# EasyEDA Pro project 51温度传感器.eprj

# Schematic Schematic1
Create Date: 2024-03-05; Page Name: P1; Project Name: 51温度传感器; Schematic Name: Schematic1; Update Date: 2024-03-05; Company: 嘉立创EDA; Page Size: A4; Version: V1.0
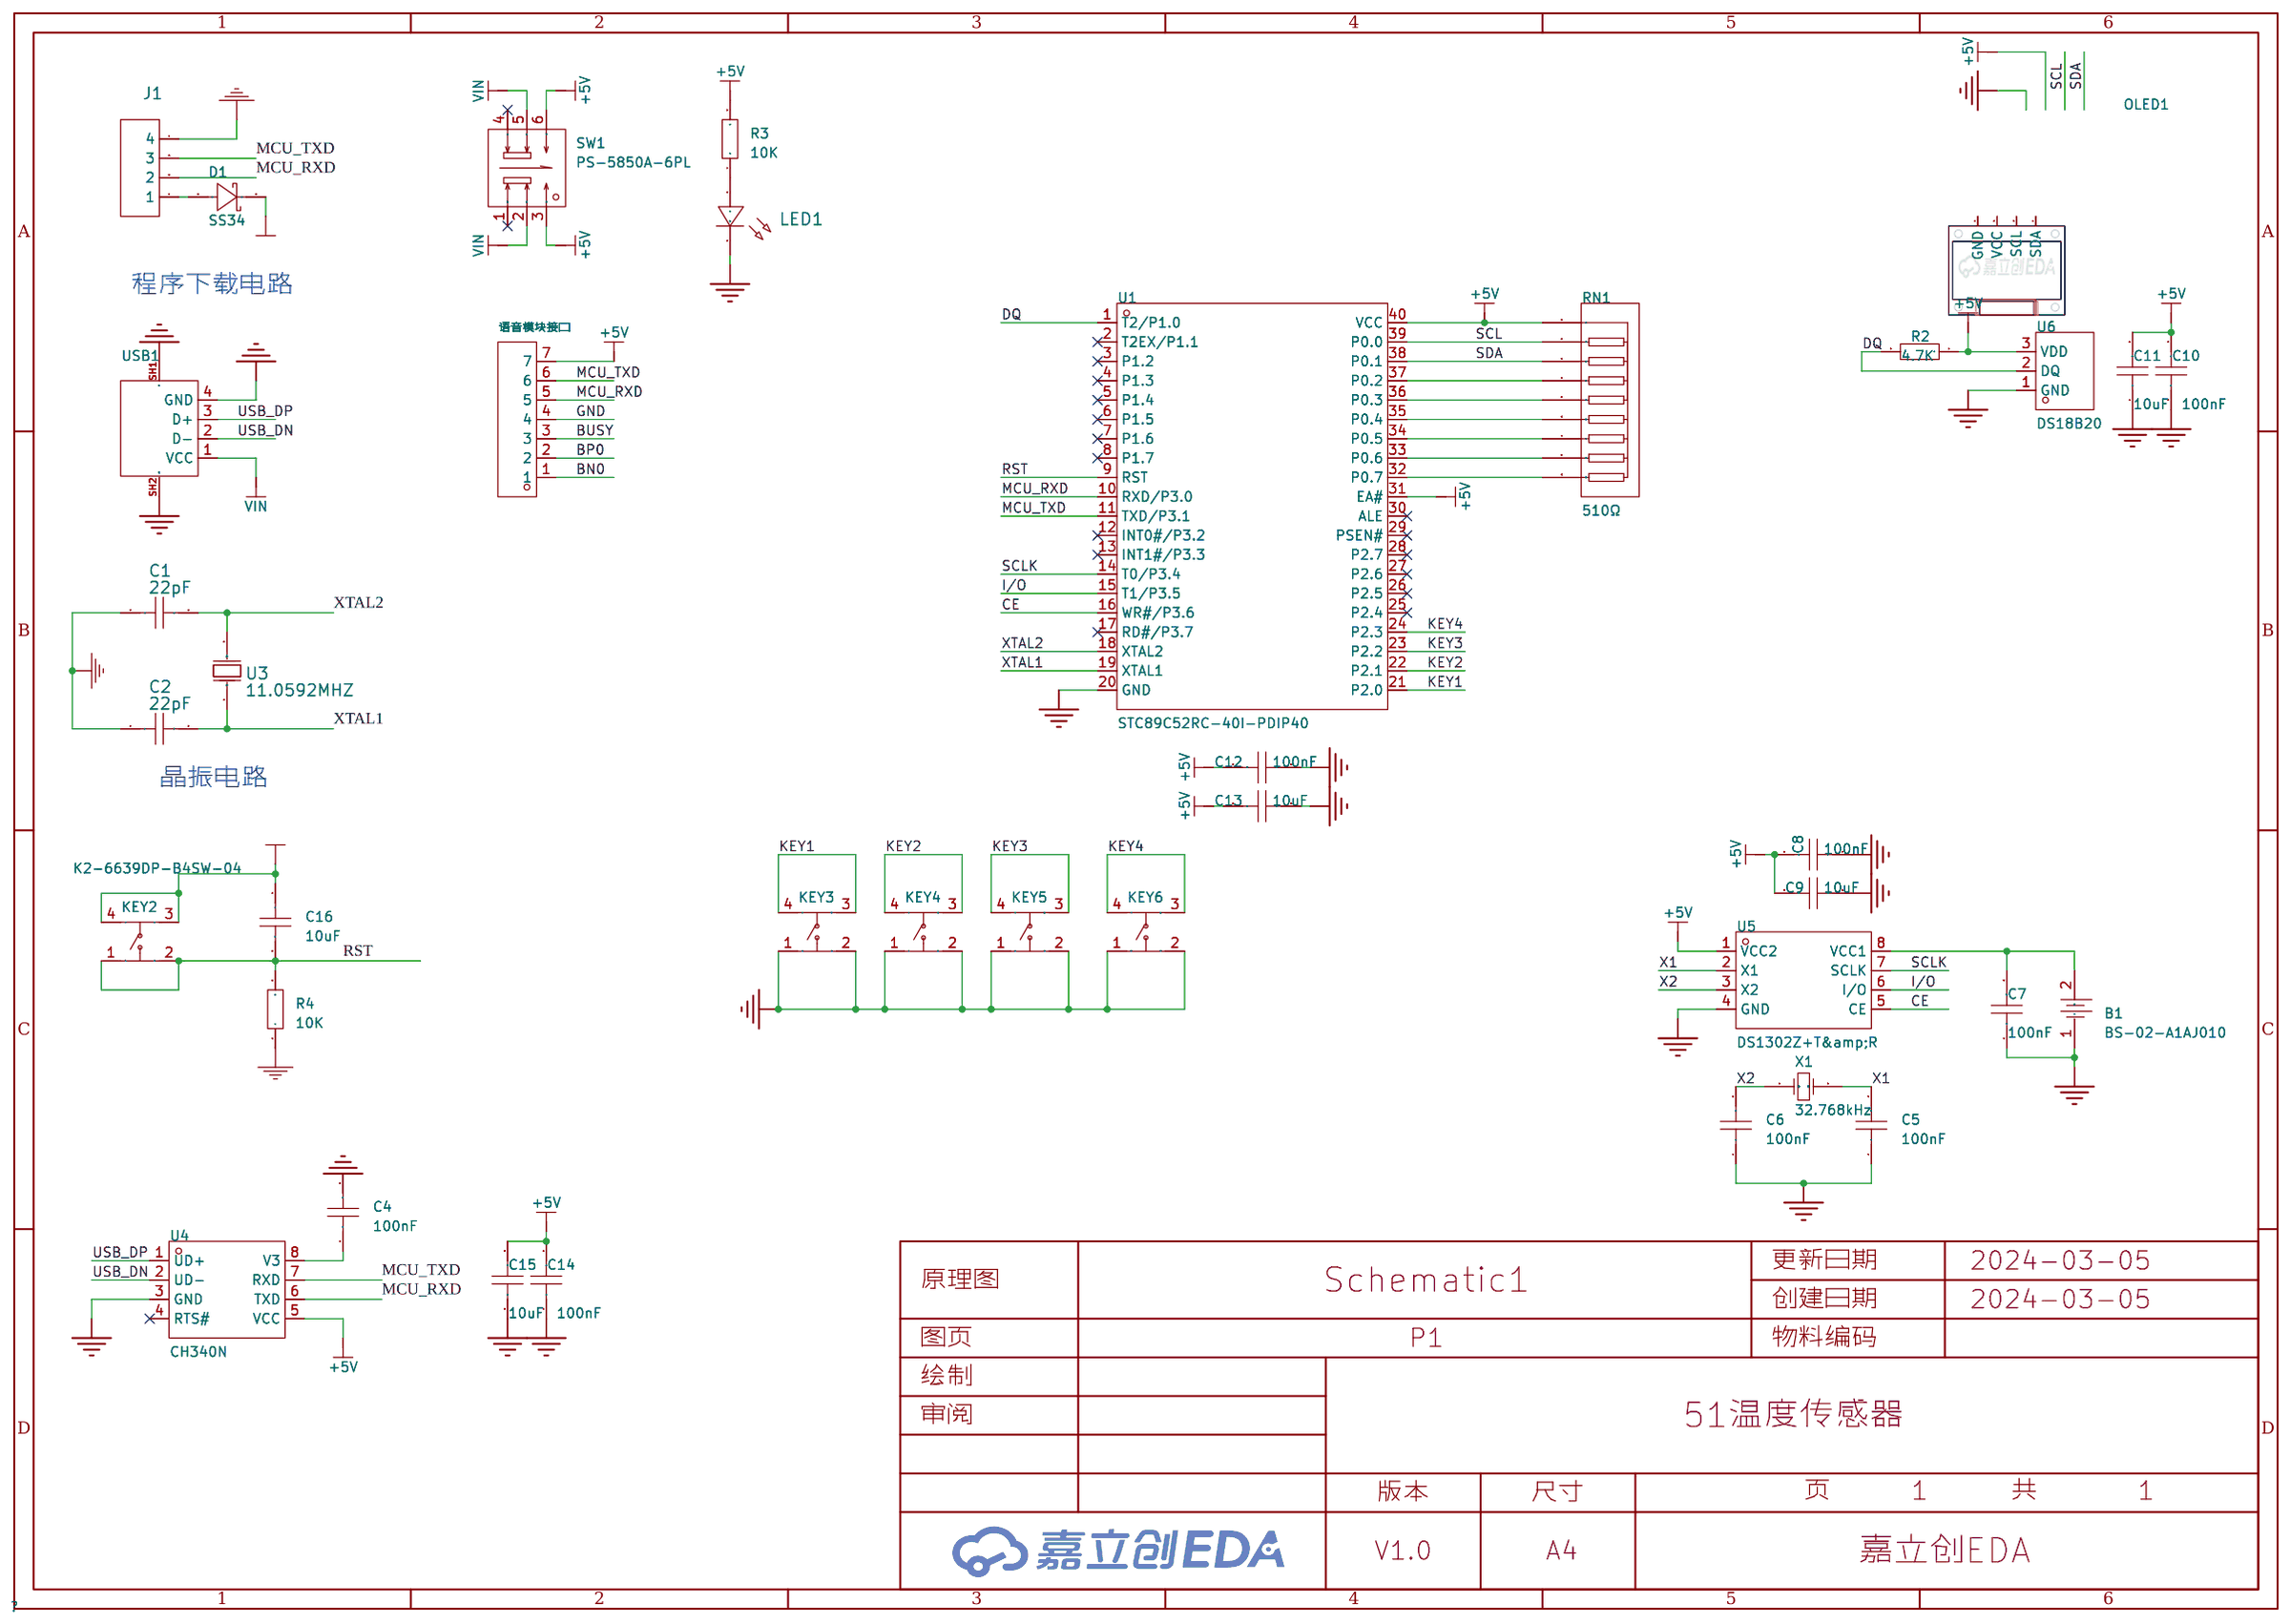
[diagram p0: schematic sheet]

## Parts
B1  BS-02-A1AJ010  [BAT-TH_BS-02-A1AJ010]
C1  22pF  [C0603]
C2  22pF  [C0603]
C4  100nF  [C0603]
C5  100nF  [C0603]
C6  100nF  [C0603]
C7  100nF  [C0603]
C8  100nF  [C0603]
C9  10uF  [C0603]
C10  100nF  [C0603]
C11  10uF  [C0603]
C12  100nF  [C0603]
C13  10uF  [C0603]
C14  100nF  [C0603]
C15  10uF  [C0603]
C16  10uF  [C0603]
D1  SS34  [SMA_L4.3-W2.5-LS5.0-RD]
J1  HDR-M-2.54_1x4  [HDR-M-2.54_1X4]
KEY2  K2-6639DP-B4SW-04  [KEY-TH_4P-L6.0-W6.0-P3.90-LS7.8]
KEY3  K2-6639DP-B4SW-04  [KEY-TH_4P-L6.0-W6.0-P3.90-LS7.8]
KEY4  K2-6639DP-B4SW-04  [KEY-TH_4P-L6.0-W6.0-P3.90-LS7.8]
KEY5  K2-6639DP-B4SW-04  [KEY-TH_4P-L6.0-W6.0-P3.90-LS7.8]
KEY6  K2-6639DP-B4SW-04  [KEY-TH_4P-L6.0-W6.0-P3.90-LS7.8]
LED1  -  [LED_0603]
OLED1  -  [0.96OLED_4P]
R2  4.7K  [R0603]
R3  10K  [R0603]
R4  10K  [R0603]
RN1  510Ω  [RES-ARRAY-TH_9P-P2.54-D1.0]
SW1  PS-5850A-6PL  [SW-TH_6P-L5.8-W5.8-P2.00-LS4.5-BL]
U1  STC89C52RC-40I-PDIP40  [DIP-40_L52.0-W13.7-P2.54-LS15.2-BL]
U3  11.0592MHZ  [HC-49US_L11.5-W4.5-P4.88]
U4  CH340N  [SOP-8_L5.0-W4.0-P1.27-LS6.0-BL]
U5  DS1302Z+T&amp;R  [SOIC-8_L4.9-W3.9-P1.27-LS6.0-BL]
U6  DS18B20  [TO-92-3_L4.9-W3.7-P1.27-L]
USB1  -  [USB_ Type-A]
X1  32.768kHz  [OSC-TH_BD1.0-P0.50]
语音模块接口  -  [HDR-TH_7P-P2.54-V-M]

## Library data of the parts
B1 = BS-02-A1AJ010: 连接器类型:电池底座;适用电池规格:CR2032;工作温度范围:-25℃~+85℃;; LCSC Part Name: 电池底座 适用电池:CR2032; Supplier Part: C5239862; Manufacturer: MYOUNG(美阳); Supplier Footprint: 插件; JLCPCB Part Class: 扩展库; Datasheet: https://atta.szlcsc.com/upload/public/pdf/source/20221102/8F00F2B23A2A3C447A59C327BBA6C743.pdf; Supplier: LCSC; Connector Type: 电池底座; Battery Type: CR2032; Operating Temperature Range: -25℃~+85℃
C1 C2 = 22pF: link: https://item.szlcsc.com/362304.html; 3DModel: C0603_L1.6-W0.8-H0.8
C4-C16 = CAP_0603: Supplier Footprint: 0603
D1 = SS34_C727060: 二极管配置:独立式;正向压降(Vf):550mV@3A;直流反向耐压(Vr):40V;平均整流电流(Io):3A;; LCSC Part Name: 电压:40V 电流:3A; Supplier Part: C727060; Manufacturer: TWGMC(台湾迪嘉); Supplier Footprint: SMA(DO-214AC); JLCPCB Part Class: Extended Part; Datasheet: https://atta.szlcsc.com/upload/public/pdf/source/20200828/C727059_6599B6CAC5F3238B9C33E46794659DBE.pdf; Supplier: LCSC; Diode Configuration: 独立式; Forward Voltage (Vf@If): 550mV@3A; Reverse Voltage (Vr): 40V; Average Rectified Current (Io): 3A; Reverse Leakage Current (Ir): 500uA@40V
J1 = HDR-M-2.54_1x4: Supplier Part: C124378; Supplier: LCSC
KEY2-KEY6 = K2-6639DP-B4SW-04: 电路结构:单刀单掷;按钮形状:圆形按钮;作用力:250gf;安装方式:直插;开关长度:6mm;开关宽度:6mm;开关高度:4.5mm;触点电流:50mA;额定电压(DC):12V;绝缘电阻:100MΩ;带灯:-;机械寿命:100万次;; LCSC Part Name: 6x6x4.5mm 轻触按键; Supplier Part: C83205; Manufacturer: 韩国韩荣; Supplier Footprint: 插件; JLCPCB Part Class: 扩展库; Datasheet: https://atta.szlcsc.com/upload/public/pdf/source/20200930/C879729_D64208FBC493D1F79DAD0BCE8DC57AB4.pdf; Supplier: LCSC; Circuit: 单刀单掷; Actuator Style: 圆形按钮; Operating Force: 250gf; Mounting Style: 直插; Switch Length: 6mm; Switch Width: 6mm; Switch Height: 4.5mm; Contact Current: 50mA; Voltage Rating (DC): 12V; Insulation Resistance: 100MΩ; Mechanical Life: 100万次; Operating Temperature: -25℃~+85℃
LED1 = LED_0603-R: Supplier Footprint: 0603
OLED1 = 0.96OLED模块_4P: Supplier Footprint: 插件
R2-R4 = Res_0603: Supplier Footprint: 0603
RN1 = A09-511JP: 电阻器数:8;阻值:510Ω;精度:±5%;单个元件功率:125mW;温度系数:±100ppm/℃;; LCSC Part Name: 510Ω ±5%; Supplier Part: C88134; Manufacturer: FH(风华); Supplier Footprint: SIP-9-2.54mm; JLCPCB Part Class: 扩展库; Datasheet: https://atta.szlcsc.com/upload/public/pdf/source/20181030/C304054_A50D38FAF64ED3A213CD1DFA70BBC452.pdf; Supplier: LCSC; Number of Resistors: 8; Tolerance: ±5%; Power(Watts): 125mW; Temperature Coefficient: ±100ppm/℃; Number of Pins: 9
SW1 = PS-5850A-6PL: 5.8自锁按键开关 高头 耐高温; LCSC Part Name: 自锁按键开关; Supplier Part: C963201; Manufacturer: G-Switch(品赞); Supplier Footprint: 插件,5.8x5.8x10mm; JLCPCB Part Class: Extended Part; Datasheet: https://atta.szlcsc.com/upload/public/pdf/source/20201201/C963201_9229C247AC907A82E381B4EE0BC1DEDE.pdf; Supplier: LCSC
U1 = STC89C52RC-40I-PDIP40: CPU内核:51系列;程序存储容量:8KB;RAM总容量:512Byte;GPIO端口数量:35;工作电压范围:3.3V~5.5V;CPU最大主频:-;程序存储器类型:FLASH;; Supplier Part: C14022; Manufacturer: STC(宏晶); Supplier Footprint: DIP-40; JLCPCB Part Class: 扩展库; Datasheet: https://atta.szlcsc.com/upload/public/pdf/source/20210104/C14022_3E6032FDBB5DBC6F971AD019A8472F5B.pdf; Supplier: LCSC; CPU Core: 51系列; Program Storage Size: 8KB; RAM Size: 512Byte; GPIO Ports Number: 35; Operating Voltage Range: 3.3V~5.5V; Program Memory Type: FLASH; Operating Temperature Range: -40℃~+85℃; 16Bit Timer: 3; UART/USART: 1; Peripheral/Function: 看门狗; Watchdog: 有
U3 = 11.0592MHZ: link: https://lcsc.com/product-detail/DIP-Crystal-Resonators_Made-in-China-Made-in-China-37-5Mhz-20PF-20PPM_C52062.html; 3DModel: HC-49US_L11.0-W4.5-H3.5-P4.88; Supplier: LCSC; Supplier Part: C2636398; Manufacturer: TXC(台湾晶技); Manufacturer Part: 9B-11.0592MAAJ-B; JLCPCB Part Class: ExtendedPart
U4 = CH340N_C506813: 应用功能:-;接口协议:-;; LCSC Part Name: USB转串口芯片 CH340; Supplier Part: C506813; Manufacturer: WCH(南京沁恒); Supplier Footprint: SOP-8; JLCPCB Part Class: 扩展库; Datasheet: https://atta.szlcsc.com/upload/public/pdf/source/20200819/C84681_ADBED554CE321879DBD6B1D06488689C.pdf; Supplier: LCSC
U5 = DS1302Z+T&R: 接口:SPI;; Supplier Part: C8959; Manufacturer: ADI(亚德诺)/MAXIM(美信); Supplier Footprint: SOIC-8; JLCPCB Part Class: 扩展库; Datasheet: https://atta.szlcsc.com/upload/public/pdf/source/20130705/1457706621880.pdf; Supplier: LCSC; Interface: SPI; Operating Voltage: 2V~5.5V; Operating Temperature: 0℃~+70℃
U6 = DS18B20_C5379069: 温度范围:-55℃~+125℃;精度:±0.4℃;接口类型:-;; Supplier Part: C5379069; Manufacturer: MSKSEMI(美森科); Supplier Footprint: TO-92; JLCPCB Part Class: Extended Part; Datasheet: https://atta.szlcsc.com/upload/public/pdf/source/20230321/E2B7C84673F98AE08C6B0E4EDF67430D.pdf; Supplier: LCSC; Temperature range: -55℃~+125℃; Resolution: ±0.4℃; Supply Voltage: 2.5V~5.5V; Standby Current: 750nA
USB1 = USB_ Type-A: Supplier Footprint: 插件
X1 = K153276812520: 晶振类型:直插晶振;频率:32.768kHz;常温频差:±20ppm;外接负载电容:12.5pF;频率稳定度(全温):±20ppm;; LCSC Part Name: 32.768kHz ±20ppm 12.5pF; Supplier Part: C368784; Manufacturer: KYX(凯越翔); Supplier Footprint: DT-15; JLCPCB Part Class: 扩展库; Datasheet: https://atta.szlcsc.com/upload/public/pdf/source/20190218/C368784_8FA95DFC5BE0B4C124C1750D22619549.pdf; Supplier: LCSC; Crystal Type: 直插晶振; Normal temperature Frequency Tolerance: ±20ppm; External load capacitor: 12.5pF; Frequency Stability(Full temperature range): ±20ppm; Equivalent Series Resistance (ESR): 70kΩ; Operating Temperature: -20℃~+70℃
语音模块接口 = HDR-M_2.54_1x7P: Supplier Part: C492406; Supplier Footprint: 插件

## Nets
+5V: C8.2 C9.2 C10.2 C11.2 C12.2 C13.2 C14.2 C15.2 C16.1 D1.1(C) KEY2.3 KEY2.4 R2.1 R3.2 RN1.1 SW1.3 SW1.6 U1.31(EA#) U1.40(VCC) U4.5(VCC) U5.1(VCC2) U6.3(VDD) 语音模块接口.7
GND: B1.1 C1.1 C2.1 C4.2 C5.1 C6.1 C7.1 C8.1 C9.1 C10.1 C11.1 C12.1 C13.1 C14.1 C15.1 J1.4 KEY3.1 KEY3.2 KEY4.1 KEY4.2 KEY5.1 KEY5.2 KEY6.1 KEY6.2 LED1.1(C) R4.1 U1.20(GND) U4.3(GND) U5.4(GND) U6.1(GND) USB1.4(GND) USB1.SH1 USB1.SH2 语音模块接口.4
VIN: SW1.2 SW1.5 USB1.1(VCC)
BN0: 语音模块接口.1
BP0: 语音模块接口.2
BUSY: 语音模块接口.3
CE: U1.16(WR#/P3.6) U5.5(CE)
DQ: R2.2 U1.1(T2/P1.0) U6.2(DQ)
I/O: U1.15(T1/P3.5) U5.6(I/O)
KEY1: KEY3.3 KEY3.4 U1.21(P2.0)
KEY2: KEY4.3 KEY4.4 U1.22(P2.1)
KEY3: KEY5.3 KEY5.4 U1.23(P2.2)
KEY4: KEY6.3 KEY6.4 U1.24(P2.3)
MCU_RXD: J1.2 U1.10(RXD/P3.0) U4.6(TXD) 语音模块接口.5
MCU_TXD: J1.3 U1.11(TXD/P3.1) U4.7(RXD) 语音模块接口.6
RST: C16.2 KEY2.1 KEY2.2 R4.2 U1.9(RST)
SCL: RN1.2 U1.39(P0.0)
SCLK: U1.14(T0/P3.4) U5.7(SCLK)
SDA: RN1.3 U1.38(P0.1)
USB_DN: U4.2(UD-) USB1.2(D-)
USB_DP: U4.1(UD+) USB1.3(D+)
X1: C5.2 U5.2(X1) X1.2(OSC2)
X2: C6.2 U5.3(X2) X1.1(OSC1)
XTAL1: C2.2 U1.19(XTAL1) U3.1(OSC1)
XTAL2: C1.2 U1.18(XTAL2) U3.2(OSC2)
$1N559: RN1.4 U1.37(P0.2)
$1N560: RN1.5 U1.36(P0.3)
$1N561: RN1.6 U1.35(P0.4)
$1N562: RN1.7 U1.34(P0.5)
$1N563: RN1.8 U1.33(P0.6)
$1N564: RN1.9 U1.32(P0.7)
$1N848: D1.2(A) J1.1
$1N1132: C4.1 U4.8(V3)
$1N1910: B1.2 C7.2 U5.8(VCC1)
Net-(LED1-2): LED1.2(A) R3.1

Not connected (* = marked no-connect by the designer): OLED1 1(GND) 2(VCC) 3(SCL) 4(SDA); SW1 1* 4*; U1 2(T2EX/P1.1)* 3(P1.2)* 4(P1.3)* 5(P1.4)* 6(P1.5)* 7(P1.6)* 8(P1.7)* 12(INT0#/P3.2)* 13(INT1#/P3.3)* 17(RD#/P3.7)* 25(P2.4)* 26(P2.5)* 27(P2.6)* 28(P2.7)* 29(PSEN#)* 30(ALE)*; U4 4(RTS#)*

## Notes on the sheet
- 程序下载电路
- 晶振电路

# Board PCB1
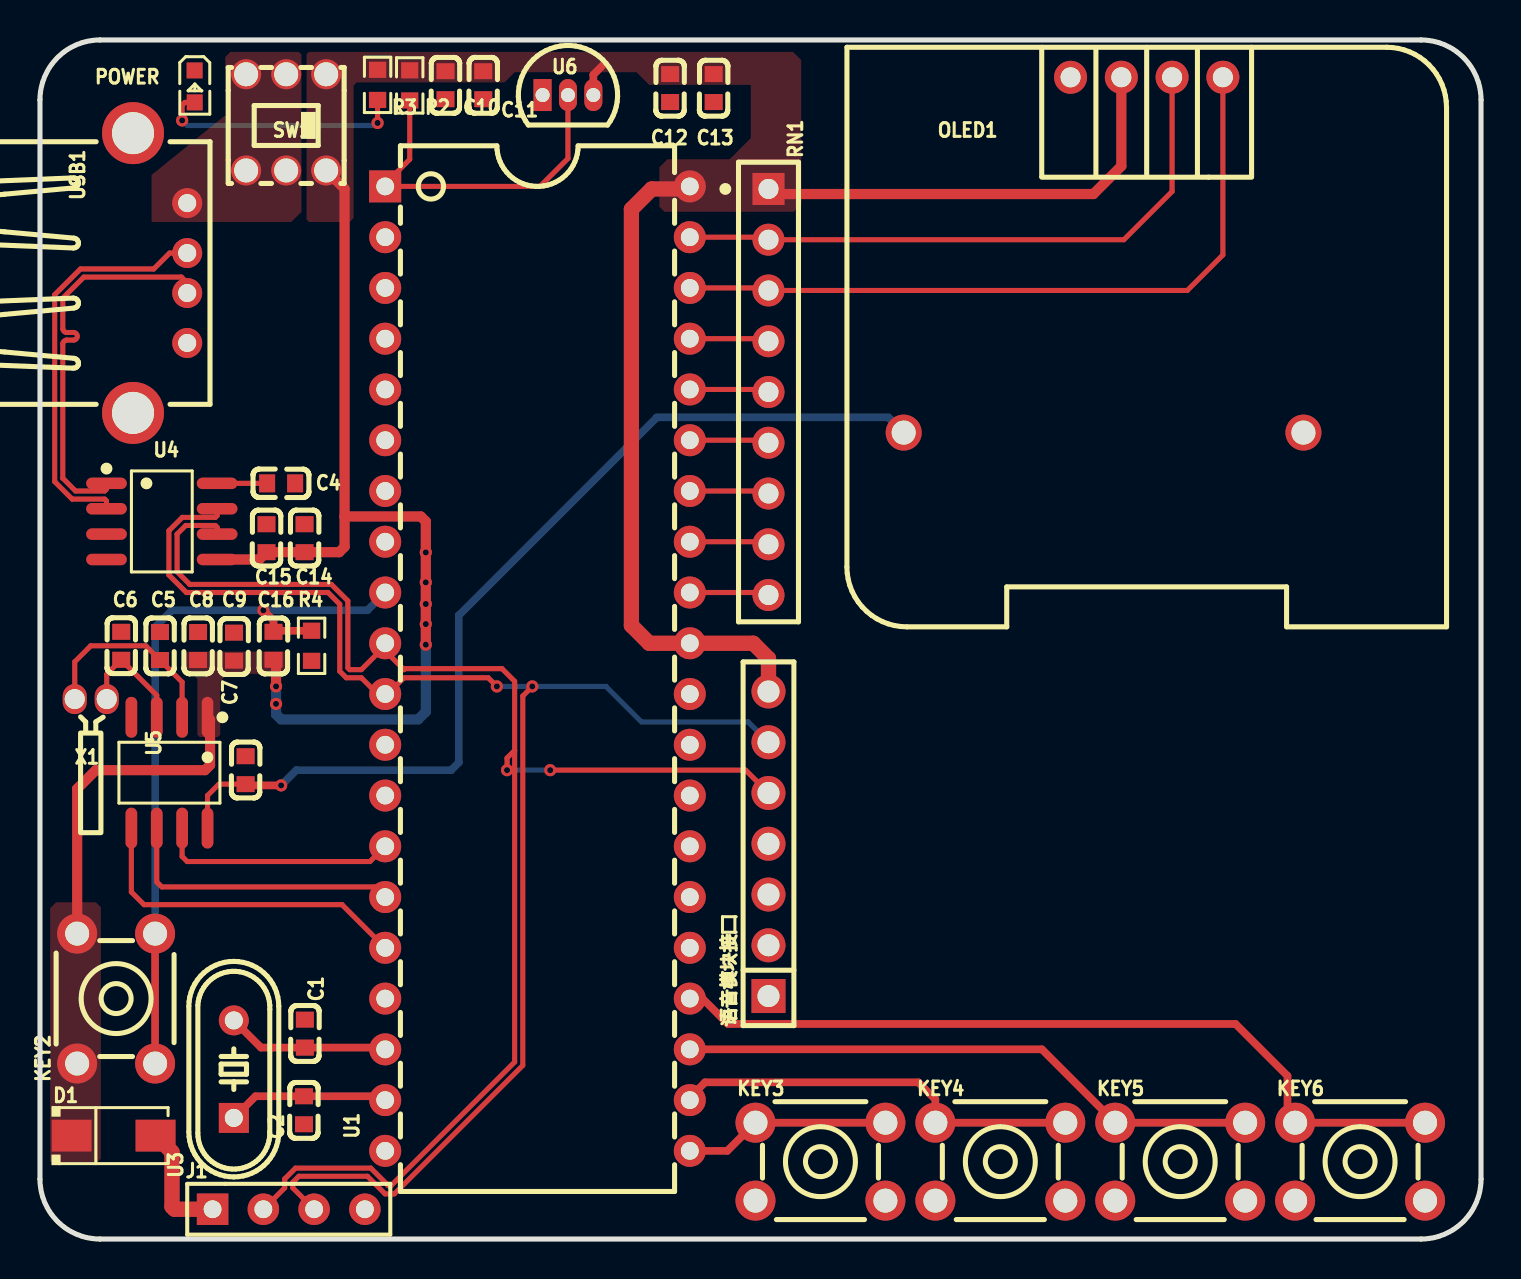
[diagram p1: board, top side]
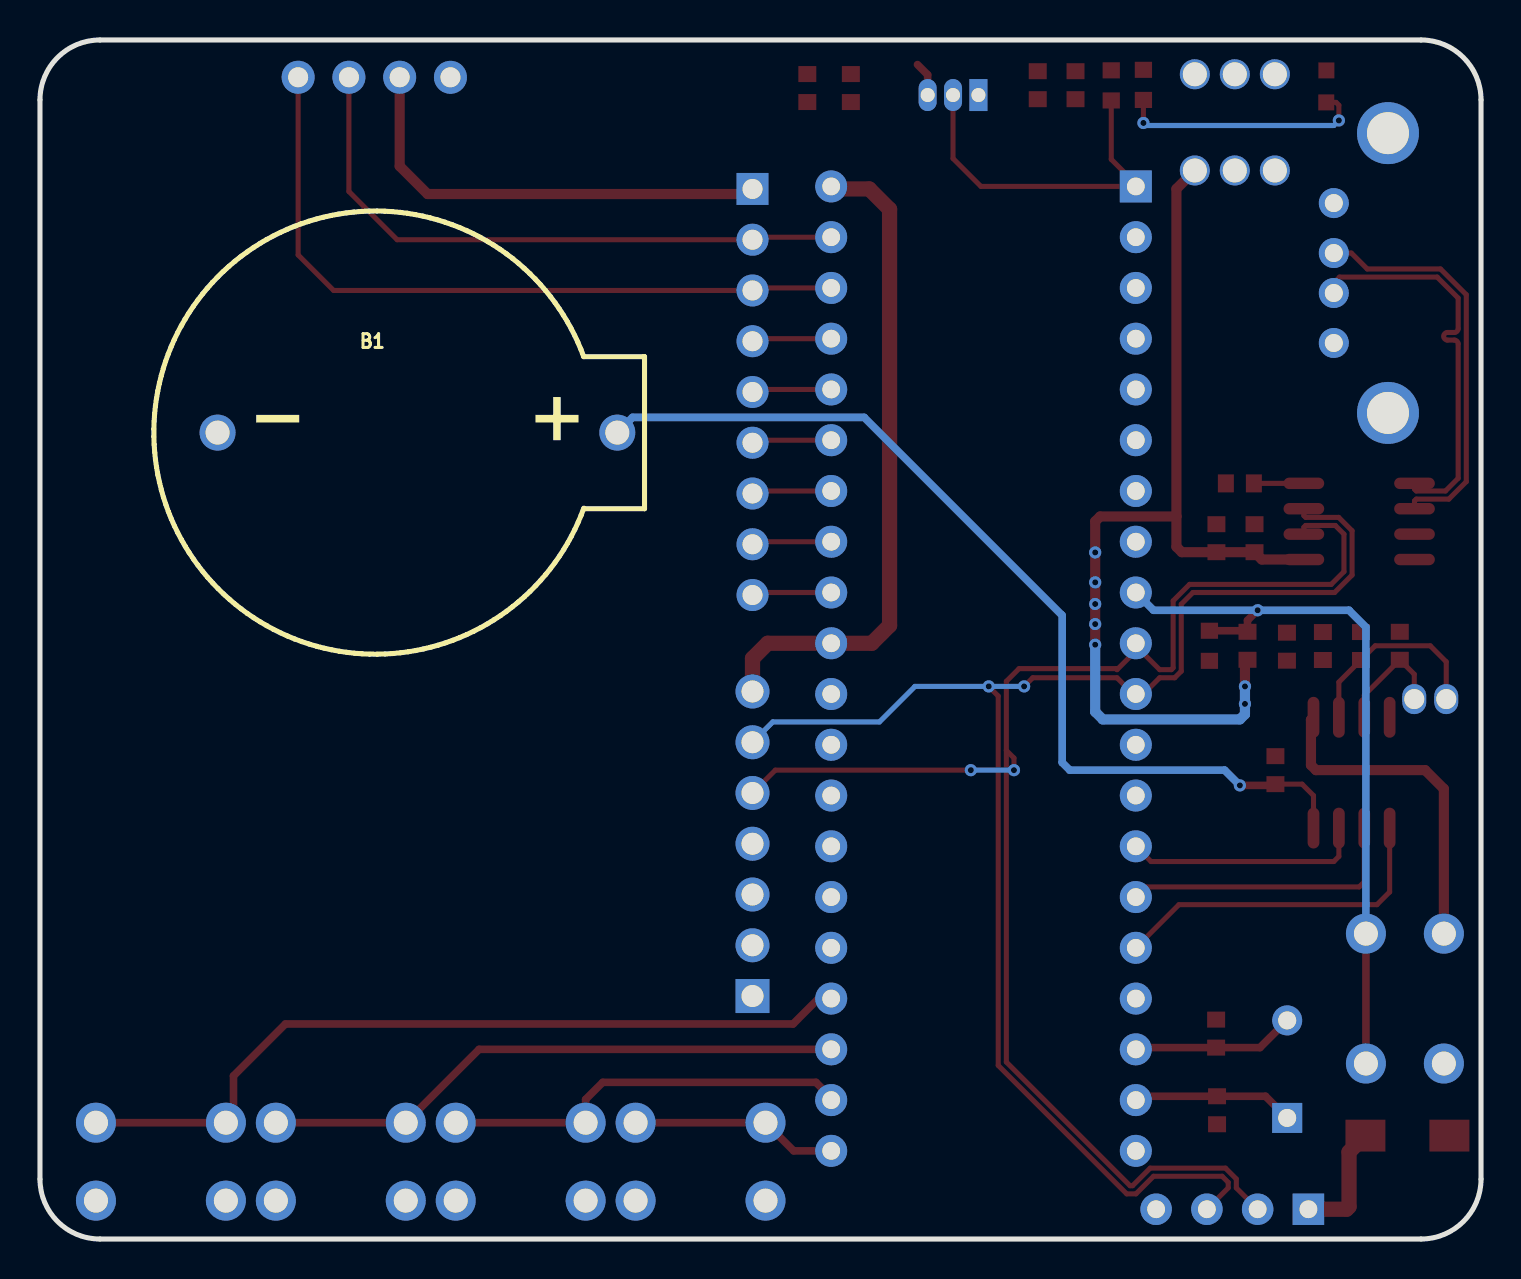
[diagram p2: board, bottom side, seen from below]

Outline 72.1 x 60 mm; copper layers: Top Layer, Bottom Layer. Coordinates in mm from the lower left corner of the outline.
Outline path: 0,57 0,3 arc(0.88,0.88) 3,0 69.1,0 arc(71.22,0.88) 72.1,3 72.1,57 arc(71.22,59.12) 69.1,60 3,60 arc(0.88,59.12) 0,57
Stack: Top Layer 0.035mm / Dielectric1 1.51mm FR4 er 4.5 / Bottom Layer 0.035mm

## Design rules (mm)
net MCU_RXD: DP2
net MCU_TXD: DP2
net USB_DN: DP1
net USB_DP: DP1
template: 自定义配置
spacing copperThickness1oz (default): track to track 0.152, other pairs 0.152 to 0.152
spacing copperThickness2oz: track to track 0.203, other pairs 0.152 to 0.3
track width copperThickness1oz (default): min 0.127, default 0.254, max 2.54
track width copperThickness2oz: min 0.203, default 0.254, max 2.54
differential pair differentialPair (default): width min 0.127, default 0.254, max 2.54; gap min 0.152, default 0.152
via viaSize (default): diameter min 0.5, default 0.61, max 10; hole min 0.3, default 0.305, max 6.299

## Placement (name value [footprint] x y rotation side)
B1  BS-02-A1AJ010  [BAT-TH_BS-02-A1AJ010]  53.21 40.35 180 bottom
C1  22pF  [C0603]  13.25 10.28 270 top
C2  22pF  [C0603]  13.21 6.44 90 top
C4  100nF  [C0603]  12.06 37.81 0 top
C5  100nF  [C0603]  6.01 29.67 270 top
C6  100nF  [C0603]  4.06 29.68 270 top
C7  100nF  [C0603]  10.29 23.46 270 top
C8  100nF  [C0603]  7.91 29.67 270 top
C9  10uF  [C0603]  9.71 29.64 270 top
C10  100nF  [C0603]  20.29 57.74 90 top
C11  10uF  [C0603]  22.18 57.74 90 top
C12  100nF  [C0603]  31.53 57.59 90 top
C13  10uF  [C0603]  33.71 57.59 90 top
C14  100nF  [C0603]  13.24 35.07 270 top
C15  10uF  [C0603]  11.33 35.07 270 top
C16  10uF  [C0603]  11.68 29.68 90 top
D1  SS34  [SMA_L4.3-W2.5-LS5.0-RD]  3.68 5.17 0 top
J1  HDR-M-2.54_1x4  [HDR-M-2.54_1X4]  12.45 1.49 0 top
KEY2  K2-6639DP-B4SW-04  [KEY-TH_4P-L6.0-W6.0-P3.90-LS7.8]  3.81 12.03 90 top
KEY3  K2-6639DP-B4SW-04  [KEY-TH_4P-L6.0-W6.0-P3.90-LS7.8]  39.05 3.87 0 top
KEY4  K2-6639DP-B4SW-04  [KEY-TH_4P-L6.0-W6.0-P3.90-LS7.8]  48.05 3.87 0 top
KEY5  K2-6639DP-B4SW-04  [KEY-TH_4P-L6.0-W6.0-P3.90-LS7.8]  57.05 3.87 0 top
KEY6  K2-6639DP-B4SW-04  [KEY-TH_4P-L6.0-W6.0-P3.90-LS7.8]  66.05 3.87 0 top
OLED1  -  [0.96OLED_4P]  55.37 58.13 0 top
POWER  -  [LED_0603]  7.75 57.62 270 top
R2  4.7K  [R0603]  18.5 57.73 270 top
R3  10K  [R0603]  16.89 57.75 90 top
R4  10K  [R0603]  13.59 29.68 90 top
RN1  510Ω  [RES-ARRAY-TH_9P-P2.54-D1.0]  36.45 42.38 270 top
SW1  PS-5850A-6PL  [SW-TH_6P-L5.8-W5.8-P2.00-LS4.5-BL]  12.32 55.72 0 top
U1  STC89C52RC-40I-PDIP40  [DIP-40_L52.0-W13.7-P2.54-LS15.2-BL]  24.89 28.54 270 top
U3  11.0592MHZ  [HC-49US_L11.5-W4.5-P4.88]  9.7 8.5 90 top
U4  CH340N  [SOP-8_L5.0-W4.0-P1.27-LS6.0-BL]  6.1 35.91 270 top
U5  DS1302Z+T&amp;R  [SOIC-8_L4.9-W3.9-P1.27-LS6.0-BL]  6.48 23.33 180 top
U6  DS18B20  [TO-92-3_L4.9-W3.7-P1.27-L]  26.42 57.24 0 top
USB1  -  [USB_ Type-A]  1.91 48.35 270 top
X1  32.768kHz  [OSC-TH_BD1.0-P0.50]  2.54 27.02 180 top
语音模块接口  -  [HDR-TH_7P-P2.54-V-M]  36.45 19.78 90 top

## Footprints (pads in the part's own frame, mm; a bottom-side part is the same pattern mirrored in y, then rotated)
0.96OLED_4P
  round 1.65 hole 1: 1(-3.81,-0.002) 2(-1.27,0.002) 3(1.27,0.002) 4(3.81,0.002)
BAT-TH_BS-02-A1AJ010
  round 1.8 hole 1.2: 1(-10,0) 2(10,0)
C0603
  rect 0.8x0.9 smd: 1(-0.7,0) 2(0.7,0)
DIP-40_L52.0-W13.7-P2.54-LS15.2-BL
  rect 1.6x1.6 hole 0.889: 1(-24.13,-7.62)
  round 1.6 hole 0.889: 2(-21.59,-7.62) 3(-19.05,-7.62) 4(-16.51,-7.62) 5(-13.97,-7.62) 6(-11.43,-7.62) 7(-8.89,-7.62) 8(-6.35,-7.62) 9(-3.81,-7.62) 10(-1.27,-7.62) 11(1.27,-7.62) 12(3.81,-7.62) 13(6.35,-7.62) 14(8.89,-7.62) 15(11.43,-7.62) 16(13.97,-7.62) 17(16.51,-7.62) 18(19.05,-7.62) 19(21.59,-7.62) 20(24.13,-7.62) 21(24.13,7.62) 22(21.59,7.62) 23(19.05,7.62) 24(16.51,7.62) 25(13.97,7.62) 26(11.43,7.62) 27(8.89,7.62) 28(6.35,7.62) 29(3.81,7.62) 30(1.27,7.62) 31(-1.27,7.62) 32(-3.81,7.62) 33(-6.35,7.62) 34(-8.89,7.62) 35(-11.43,7.62) 36(-13.97,7.62) 37(-16.51,7.62) 38(-19.05,7.62) 39(-21.59,7.62) 40(-24.13,7.62)
HC-49US_L11.5-W4.5-P4.88
  rect 1.5x1.5 hole 0.9: 1(-2.44,0)
  round 1.5 hole 0.9: 2(2.44,0)
HDR-M-2.54_1X4
  rect 1.575x1.575 hole 0.889: 1(-3.81,0)
  round 1.575 hole 0.889: 2(-1.27,0) 3(1.27,0) 4(3.81,0)
HDR-TH_7P-P2.54-V-M
  rect 1.7x1.7 hole 1.1: 1(-7.62,0)
  round 1.7 hole 1.1: 2(-5.08,0) 3(-2.54,0) 4(0,0) 5(2.54,0) 6(5.08,0) 7(7.62,0)
KEY-TH_4P-L6.0-W6.0-P3.90-LS7.8
  round 2 hole 1.2: 1(-3.25,-1.95) 2(3.25,-1.95) 3(3.25,1.95) 4(-3.25,1.95)
LED_0603
  rect 0.8x0.8 smd: 1(-0.851,-0.01) 2(0.75,-0.005)
OSC-TH_BD1.0-P0.50
  oval 1.2x1.5 hole 1: 1(-0.8,0) 2(0.8,0)
R0603
  rect 0.806x0.864 smd: 1(-0.753,0) 2(0.753,0)
RES-ARRAY-TH_9P-P2.54-D1.0
  rect 1.6x1.6 hole 1: 1(-10.16,0)
  round 1.6 hole 1: 2(-7.62,0) 3(-5.08,0) 4(-2.54,0) 5(0,0) 6(2.54,0) 7(5.08,0) 8(7.62,0) 9(10.16,0)
SMA_L4.3-W2.5-LS5.0-RD
  rect 2x1.593 smd: 1(-2.1,0) 2(2.1,0)
SOIC-8_L4.9-W3.9-P1.27-LS6.0-BL
  oval 0.588x2.045 smd: 1(-1.905,-2.772) 2(-0.635,-2.772) 3(0.635,-2.772) 4(1.905,-2.772) 5(1.905,2.772) 6(0.635,2.772) 7(-0.635,2.772) 8(-1.905,2.772)
SOP-8_L5.0-W4.0-P1.27-LS6.0-BL
  oval 0.574x2.035 smd: 1(-1.905,-2.768) 2(-0.635,-2.768) 3(0.635,-2.768) 4(1.905,-2.768) 5(1.905,2.768) 6(0.635,2.768) 7(-0.635,2.768) 8(-1.905,2.768)
SW-TH_6P-L5.8-W5.8-P2.00-LS4.5-BL
  round 1.5 hole 1.2: 1(-2.004,-2.25) 2(0,-2.25) 3(2,-2.25) 4(-2.004,2.564) 5(0,2.564) 6(2,2.564)
TO-92-3_L4.9-W3.7-P1.27-L
  rect 0.9x1.6 hole 0.7: 1(-1.27,0)
  oval 0.9x1.6 hole 0.7: 2(0,0) 3(1.27,0)
USB_ Type-A
  round 1.5 hole 0.9: 1(-3.484,5.461) 2(-0.984,5.461) 3(1.016,5.461) 4(3.516,5.461)
  round 3.1 hole 2.1: SH1(7.016,2.751) SH2(-6.984,2.751)

## Nets
As in the schematic, except:
+5V: C8.2 C9.2 C10.2 C11.2 C12.2 C13.2 C14.2 C15.2 C16.1 D1.1 KEY2.3 KEY2.4 OLED1.2 R2.1 R3.2 RN1.1 SW1.3 SW1.6 U1.31 U1.40 U4.5 U5.1 U6.3 语音模块接口.7
GND: B1.1 C1.1 C2.1 C4.2 C5.1 C6.1 C7.1 C8.1 C9.1 C10.1 C11.1 C12.1 C13.1 C14.1 C15.1 J1.4 KEY3.1 KEY3.2 KEY4.1 KEY4.2 KEY5.1 KEY5.2 KEY6.1 KEY6.2 OLED1.1 POWER.1 R4.1 U1.20 U4.3 U5.4 U6.1 USB1.4 USB1.SH1 USB1.SH2 语音模块接口.4
VIN: SW1.1 SW1.2 SW1.4 SW1.5 USB1.1
SCL: OLED1.3 RN1.2 U1.39
SDA: OLED1.4 RN1.3 U1.38
$1N2636: POWER.2 R3.1

Pads without a net: U1 2 3 4 5 6 7 8 12 13 17 25 26 27 28 29 30; U4 4

## Via types
v1: diameter 0.61, hole 0.305, Top Layer to Bottom Layer, 15 vias

## Routing (per net, layer and track width the routed paths; a pad name or vN(x,y) marks a point on that pad's centre or on a via; arc(x,y) is an arc through that point)
+5V: length 124.7
  Top Layer w0.381: 28.19,58.77 27.69,58.26 U6.3
  Top Layer w0.508: 15.24,36.16 19.06,36.16 19.3,35.91 v1(19.3,34.36) v1(19.3,32.86) v1(19.3,31.78) v1(19.3,30.77) v1(19.3,29.74) ; 15.24,36.16 15.24,52.55 SW1.3 ; 15.24,36.16 15.24,34.64 14.97,34.37 C14.2 C15.2 10.97,34 U4.5 ; RN1.1 36.7,52.29 52.7,52.29 54.1,53.69 OLED1.2 ; KEY2.3 1.86,22.53 2.79,23.46 8.25,23.46 8.51,23.72 8.51,25.98 U5.1 ; C16.1 11.81,28.86 v1(11.81,27.65)
  Top Layer w0.762: 32.39,52.67 32.26,52.54 30.61,52.54 29.59,51.53 29.59,30.7 30.48,29.81 35.69,29.81 36.45,29.05 语音模块接口.7
  Bottom Layer w0.508: v1(19.3,29.74) 19.3,26.38 18.92,26 12.06,26 11.81,26.26 v1(11.81,26.78) v1(11.81,27.65)
CE: length 17.1
  Top Layer w0.254: U5.5 4.57,17.37 5.21,16.73 15.11,16.73 U1.16
DQ: length 17.9
  Top Layer w0.254: U6.2 26.42,54.07 25.02,52.67 17.14,52.67 18.5,54.03 R2.2
I/O: length 14.4
  Top Layer w0.254: U1.15 16.76,17.62 6.1,17.62 5.84,17.87 U5.6
KEY1: length 10.5
  Top Layer w0.381: 32.39,4.41 34.39,4.41 KEY3.4 KEY3.3
KEY2: length 20.8
  Top Layer w0.381: 32.39,6.95 33.27,7.84 43.94,7.84 44.8,6.98 KEY4.4 KEY4.3
KEY3: length 29.4
  Top Layer w0.381: KEY5.3 KEY5.4 50.13,9.49 32.39,9.49
KEY4: length 40.6
  Top Layer w0.381: KEY6.3 KEY6.4 62.42,6.2 62.42,8.16 59.82,10.76 34.42,10.76 33.15,12.03 32.39,12.03
MCU_RXD: length 76.9
  Top Layer w0.254: v1(23.37,23.46) 23.37,24.07 23.75,24.45 ; v1(25.53,23.46) 35.31,23.46 语音模块接口.5 ; 23.75,24.45 23.75,27.91 23.11,28.54 18.26,28.54 18.21,28.49 17.14,29.56 16.08,28.49 15.49,28.49 15.4,28.58 15.4,31.93 14.58,32.76 7.49,32.76 6.86,33.39 6.86,35.27 7.29,35.7 8.77,35.7 8.86,35.61 U4.6 ; 23.75,24.45 23.75,8.86 17.56,2.67 17.43,2.67 16.55,3.55 12.79,3.55 12.24,3.01 12.24,2.56 J1.2
  Bottom Layer w0.254: v1(23.37,23.46) v1(25.53,23.46)
MCU_TXD: length 77.2
  Top Layer w0.254: 24.64,27.65 24.16,27.17 24.16,8.69 17.73,2.26 17.26,2.26 16.38,3.14 12.95,3.14 12.65,2.84 12.65,2.56 J1.3 ; v1(22.86,27.65) 22.43,28.08 18.21,28.08 17.14,27.02 16.08,28.08 15.33,28.08 15,28.41 15,31.77 14.41,32.35 7.32,32.35 6.45,33.22 6.45,35.44 7.12,36.11 8.77,36.11 8.86,36.2 U4.7
  Bottom Layer w0.254: v1(22.86,27.65) v1(24.63,27.65) 28.32,27.65 30.1,25.87 35.43,25.87 语音模块接口.6
RST: length 37.3
  Top Layer w0.381: v1(11.18,31.46) 11.68,30.95 C16.2 11.74,30.44 R4.2 ; KEY2.1 KEY2.2
  Bottom Layer w0.381: U1.9 16.38,31.46 v1(11.18,31.46) 6.6,31.46 5.76,30.62 KEY2.2
SCL: length 31
  Top Layer w0.254: OLED1.3 56.64,52.42 54.23,50 RN1.2 36.32,50.13 32.39,50.13
SCLK: length 12
  Top Layer w0.254: U5.7 7.11,19.14 7.37,18.89 16.51,18.89 U1.14
SDA: length 36.5
  Top Layer w0.254: 32.39,47.59 36.32,47.59 RN1.3 57.4,47.46 59.18,49.24 OLED1.4
USB_DN: length 20.2
  Top Layer w0.254: U4.2 3.33,36.94 3.24,37.03 1.61,37.03 0.74,37.9 0.74,47.25 2.03,48.54 5.69,48.54 6.49,49.34 USB1.2
USB_DP: length 20.2
  Top Layer w0.254: U4.1 3.33,37.52 3.24,37.43 1.78,37.43 1.14,38.07 1.14,44.79 arc(1.2,44.93) 1.33,44.98 1.68,44.98 arc(1.87,45.17) 1.68,45.36 1.33,45.36 arc(1.2,45.42) 1.14,45.55 1.14,47.08 2.19,48.13 7.08,48.13 7.37,47.85 USB1.3
X1: length 10.1
  Top Layer w0.254: X1.2 1.74,28.88 2.54,29.68 5.29,29.68 C5.2 7.11,27.87 U5.2
X2: length 5.9
  Top Layer w0.254: U5.3 5.84,27.21 C6.2 3.34,28.26 X1.1
XTAL1: length 8
  Top Layer w0.381: 17.14,6.95 16.95,7.14 C2.2 10.78,7.14 U3.1
XTAL2: length 8
  Top Layer w0.381: 17.14,9.49 17.06,9.58 C1.2 11.06,9.58 U3.2
$1N559: length 4.1
  Top Layer w0.254: 32.39,45.05 36.32,45.05 RN1.4
$1N560: length 4.1
  Top Layer w0.254: 32.39,42.51 36.32,42.51 RN1.5
$1N561: length 4.1
  Top Layer w0.254: RN1.6 36.32,39.97 32.39,39.97
$1N562: length 4.1
  Top Layer w0.254: 32.39,37.43 36.32,37.43 RN1.7
$1N563: length 4.1
  Top Layer w0.254: 32.39,34.89 36.32,34.89 RN1.8
$1N564: length 4.1
  Top Layer w0.254: 32.39,32.35 36.32,32.35 RN1.9
$1N848: length 6
  Top Layer w0.762: J1.1 6.73,1.49 6.6,1.62 6.6,4.35 D1.2
$1N1132: length 2.5
  Top Layer w0.254: U4.8 C4.1
$1N1910: length 49
  Top Layer w0.254: C7.2 8.95,22.76 8.38,22.19 U5.8
  Top Layer w0.381: C7.2 10.35,22.7 v1(12.06,22.7)
  Bottom Layer w0.381: B1.2 42.45,41.11 30.86,41.11 20.95,31.21 20.95,23.84 20.57,23.46 12.83,23.46 v1(12.06,22.7)
$1N2636: length 12.5
  Top Layer w0.254: POWER.2 7.25,56.88 7.11,56.74 v1(7.11,55.97) ; R3.1 v1(16.89,55.85)
  Bottom Layer w0.254: v1(16.89,55.85) 16.76,55.72 7.37,55.72 v1(7.11,55.97)

## Copper pours and planes (outline as drawn; the poured copper is in the pictures)
+5V on Top Layer: 0.51,16.85 3.05,16.85 3.05,3.77 0.51,3.77
+5V on Top Layer: 13.33,59.4 38.09,59.4 38.09,50.89 13.33,50.89
+5V on Top Layer: 7.2,29.39 12.39,29.39 12.39,25.11 7.2,25.11
GND on Top Layer: -3.43,59.91 79.25,59.91 79.25,-6.13 -3.43,-6.13
GND on Bottom Layer: -5.46,62.96 77.09,62.96 77.09,-4.61 -5.46,-4.61
VIN on Top Layer: 5.59,59.4 13.08,59.4 13.08,50.89 5.59,50.89

Small or netless copper shapes (teardrops, artwork), in the pictures only: 3 on Top Layer
